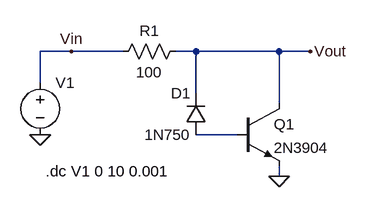
[diagram p0: schematic 09A-16.asc]
09A-16.asc, the LTspice schematic file:
Version 4.1
SHEET 1 880 680
WIRE 16 128 -32 128
WIRE 96 128 16 128
WIRE 208 128 176 128
WIRE 336 128 208 128
WIRE 384 128 336 128
WIRE -32 176 -32 128
WIRE 208 192 208 128
WIRE 336 208 336 128
WIRE 272 256 208 256
WIRE 336 320 336 304
FLAG 336 320 0
FLAG -32 256 0
FLAG 384 128 Vout
FLAG 16 128 Vin
SYMBOL res 192 112 R90
WINDOW 0 0 56 VBottom 2
WINDOW 3 32 56 VTop 2
SYMATTR InstName R1
SYMATTR Value 100
SYMBOL diode 224 256 R180
WINDOW 0 24 64 Left 2
WINDOW 3 24 0 Left 2
SYMATTR InstName D1
SYMATTR Value 1N750
SYMATTR Description Diode
SYMATTR Type diode
SYMBOL npn 272 208 R0
SYMATTR InstName Q1
SYMATTR Value 2N3904
SYMBOL voltage -32 160 R0
WINDOW 123 0 0 Left 0
WINDOW 39 0 0 Left 0
SYMATTR InstName V1
SYMATTR Value ""
TEXT -24 312 Left 2 !.dc V1 0 10 0.001

The netlist it stands for:
* 09A-16.asc
R1 Vout Vin 100
D1 N001 Vout 1N750
Q1 Vout N001 0 0 2N3904
V1 Vin 0
.model D D
.lib standard.dio
.model NPN NPN
.model PNP PNP
.lib standard.bjt
.dc V1 0 10 0.001
.backanno
.end